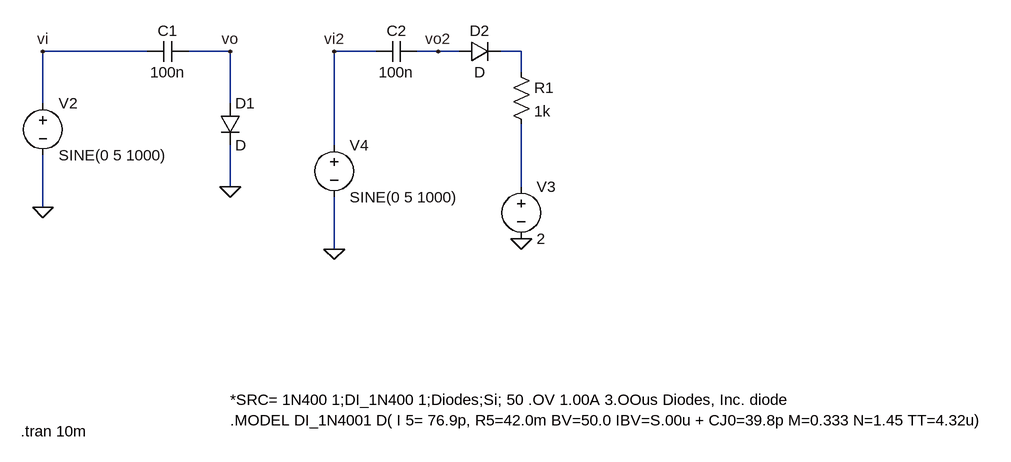
[diagram p0: schematic ECE3060_Exp7_clampercircuits.asc]
ECE3060_Exp7_clampercircuits.asc, the LTspice schematic file:
Version 4
SHEET 1 980 680
WIRE -416 -192 -576 -192
WIRE -288 -192 -352 -192
WIRE -64 -192 -128 -192
WIRE 32 -192 0 -192
WIRE 64 -192 32 -192
WIRE 160 -192 128 -192
WIRE 160 -160 160 -192
WIRE -576 -112 -576 -192
WIRE -288 -112 -288 -192
WIRE -128 -48 -128 -192
WIRE -288 16 -288 -48
WIRE 160 16 160 -80
WIRE -576 48 -576 -32
WIRE -128 112 -128 32
FLAG -576 48 0
FLAG -128 112 0
FLAG -128 -192 vi2
FLAG -576 -192 vi
FLAG -288 -192 vo
FLAG 32 -192 vo2
FLAG 160 96 0
FLAG -288 16 0
SYMBOL diode -304 -112 R0
SYMATTR InstName D1
SYMBOL voltage -576 -128 R0
WINDOW 123 0 0 Left 0
WINDOW 39 0 0 Left 0
SYMATTR InstName V2
SYMATTR Value SINE(0 5 1000)
SYMBOL diode 64 -176 R270
WINDOW 0 32 32 VTop 2
WINDOW 3 0 32 VBottom 2
SYMATTR InstName D2
SYMBOL voltage 160 0 R0
WINDOW 123 0 0 Left 0
WINDOW 39 0 0 Left 0
SYMATTR InstName V3
SYMATTR Value 2
SYMBOL voltage -128 -64 R0
WINDOW 123 0 0 Left 0
WINDOW 39 0 0 Left 0
SYMATTR InstName V4
SYMATTR Value SINE(0 5 1000)
SYMBOL cap -352 -208 R90
WINDOW 0 0 32 VBottom 2
WINDOW 3 32 32 VTop 2
SYMATTR InstName C1
SYMATTR Value 100n
SYMBOL cap 0 -208 R90
WINDOW 0 0 32 VBottom 2
WINDOW 3 32 32 VTop 2
SYMATTR InstName C2
SYMATTR Value 100n
SYMBOL res 144 -176 R0
SYMATTR InstName R1
SYMATTR Value 1k
TEXT -288 344 Left 2 !*SRC= 1N400 1;DI_1N400 1;Diodes;Si; 50 .OV 1.00A 3.OOus Diodes, Inc. diode\n.MODEL DI_1N4001 D( I 5= 76.9p, R5=42.0m BV=50.0 IBV=S.00u + CJ0=39.8p M=0.333 N=1.45 TT=4.32u)
TEXT -610 392 Left 2 !.tran 10m

The netlist it stands for:
* ECE3060_Exp7_clampercircuits.asc
D1 vo 0 D
V2 vi 0 SINE(0 5 1000)
D2 vo2 N001 D
V3 N002 0 2
V4 vi2 0 SINE(0 5 1000)
C1 vo vi 100n
C2 vo2 vi2 100n
R1 N001 N002 1k
.model D D
.lib standard.dio
*SRC= 1N400 1;DI_1N400 1;Diodes;Si; 50 .OV 1.00A 3.OOus Diodes, Inc. diode
.MODEL DI_1N4001 D( I 5= 76.9p, R5=42.0m BV=50.0 IBV=S.00u + CJ0=39.8p M=0.333 N=1.45 TT=4.32u)
.tran 10m
.backanno
.end